# EAGLE schematic CORS_Front_Panel (EAGLE 9.6.2)
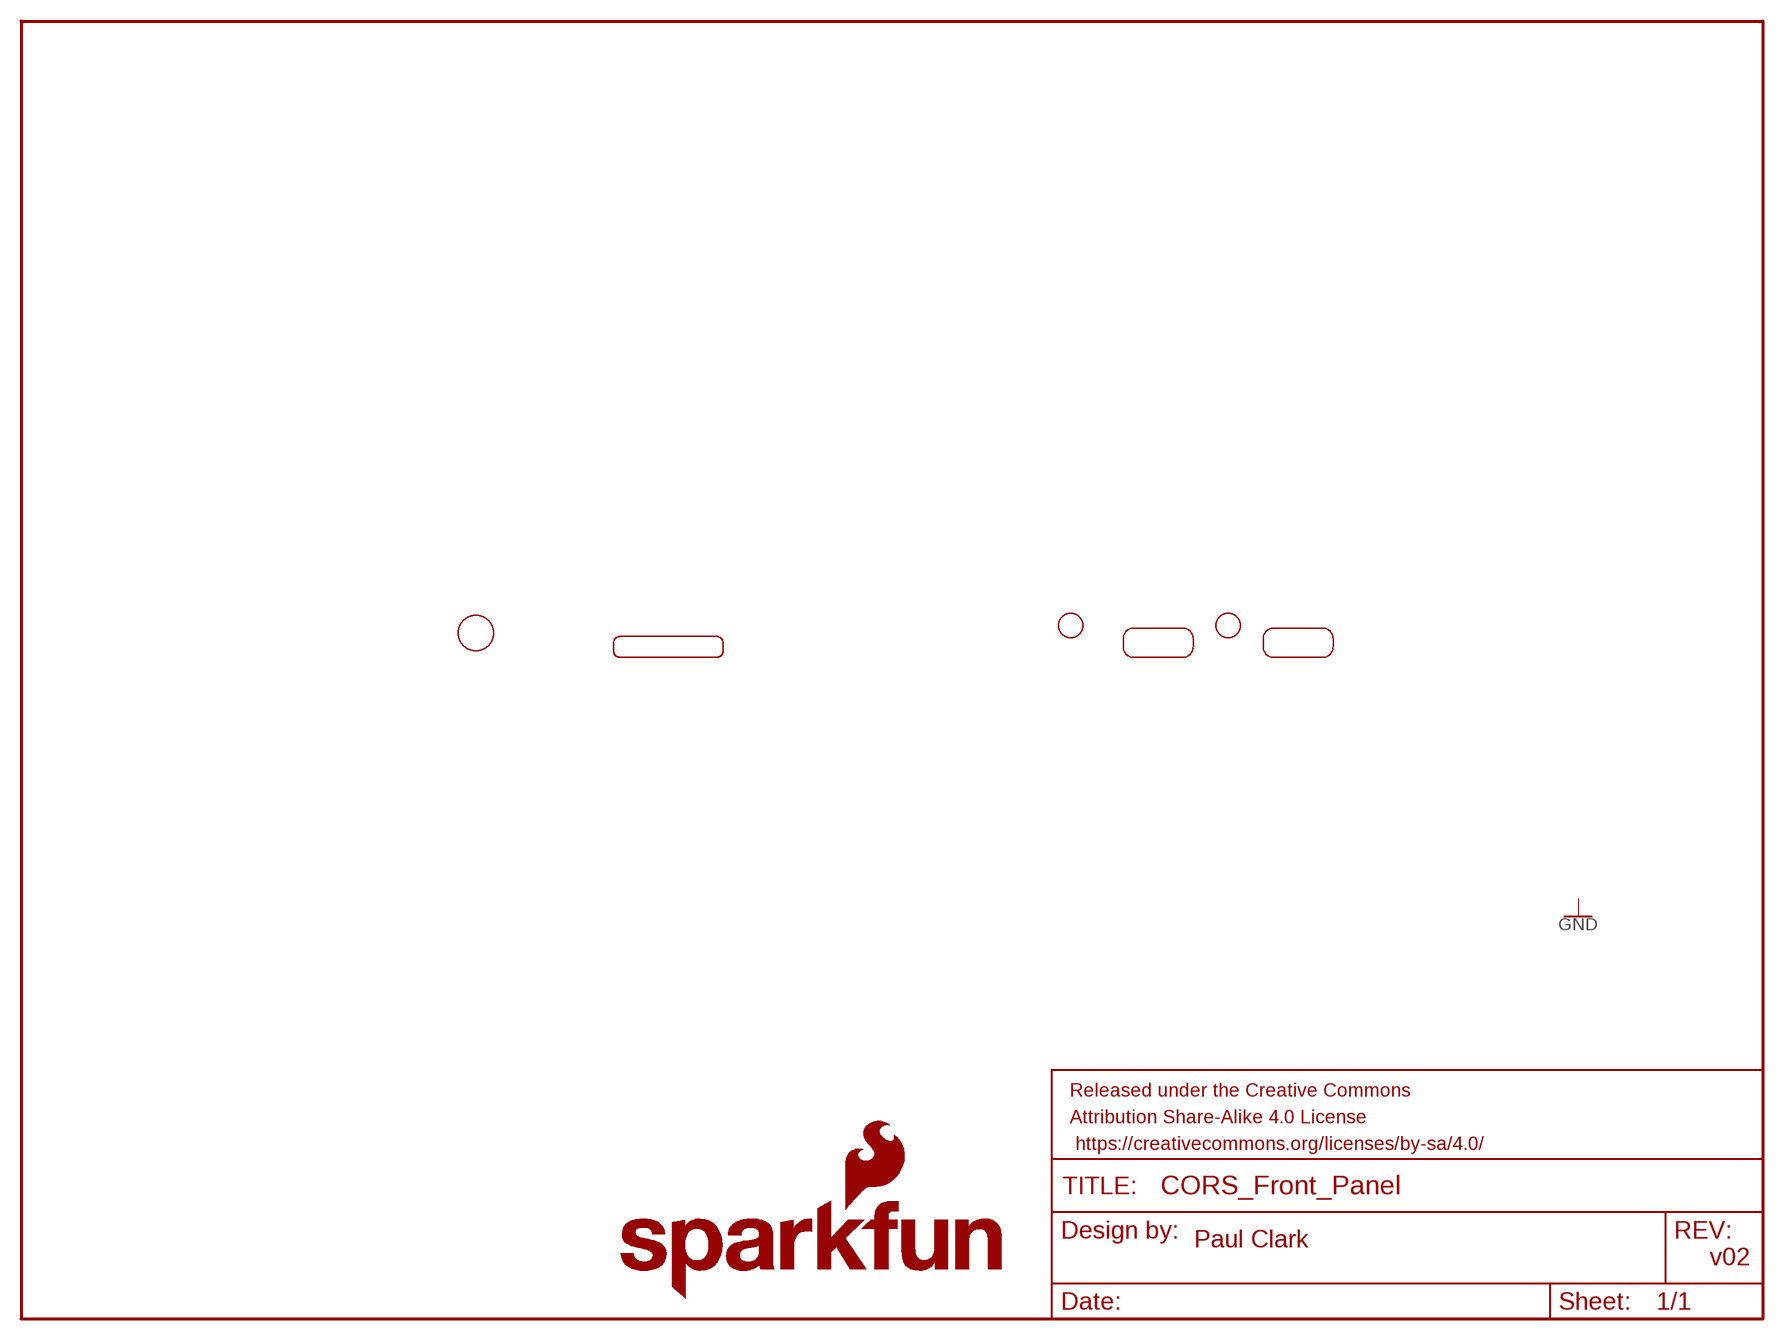
[diagram p0: schematic, sheet 1]

## Parts
BOOT  BUTTON  [BUTTON]
ESP32_USB  USB-C  [USB-C]
FRAME1  FRAME-LETTER  [CREATIVE_COMMONS]
GNSS_USB  USB-C  [USB-C]
LED  LED  [LED]
LOGO1  SFE_LOGO_NAME_FLAME.3_INCH  [SFE_LOGO_NAME_FLAME_.3]
MICRO_SD  MICRO_SD  [MICRO_SD]
RESET  BUTTON  [BUTTON]

## Notes on the sheet
- Paul Clark
- v02

## Library data of the parts
BOOT RESET = CORS_Panels:BUTTON
ESP32_USB GNSS_USB = CORS_Panels:USB-C
FRAME1 = SparkFun-Aesthetics:FRAME-LETTER: Schematic Frame - Letter Standard 8.5x11 US Letter frame
LED = CORS_Panels:LED
LOGO1 = SparkFun-Aesthetics:SFE_LOGO_NAME_FLAME: SparkFun Font Logo w/ Flame This is the SparkFun full logo. The logo on the schematic will always be the same size; the package variant is the height of the flame part of the logo. Default layer for the logo on the board is tSilk.
MICRO_SD = CORS_Panels:MICRO_SD